# Altium schematic sheet Power.SchDoc: SEB/SEGR Parry dev. PWR System
size A2; ApprovedBy: N/A; CheckedBy: N/A; Author: BPS; CompanyName: N/A; DrawnBy: BPS; Engineer: BPS; Organization: N/A; Address1: N/A; Address2: N/A; Address3: N/A; Address4: N/A; DocumentNumber: SSP-03; Revision: A; SheetNumber: 2; SheetTotal: 2; Application_BuildNumber: 1
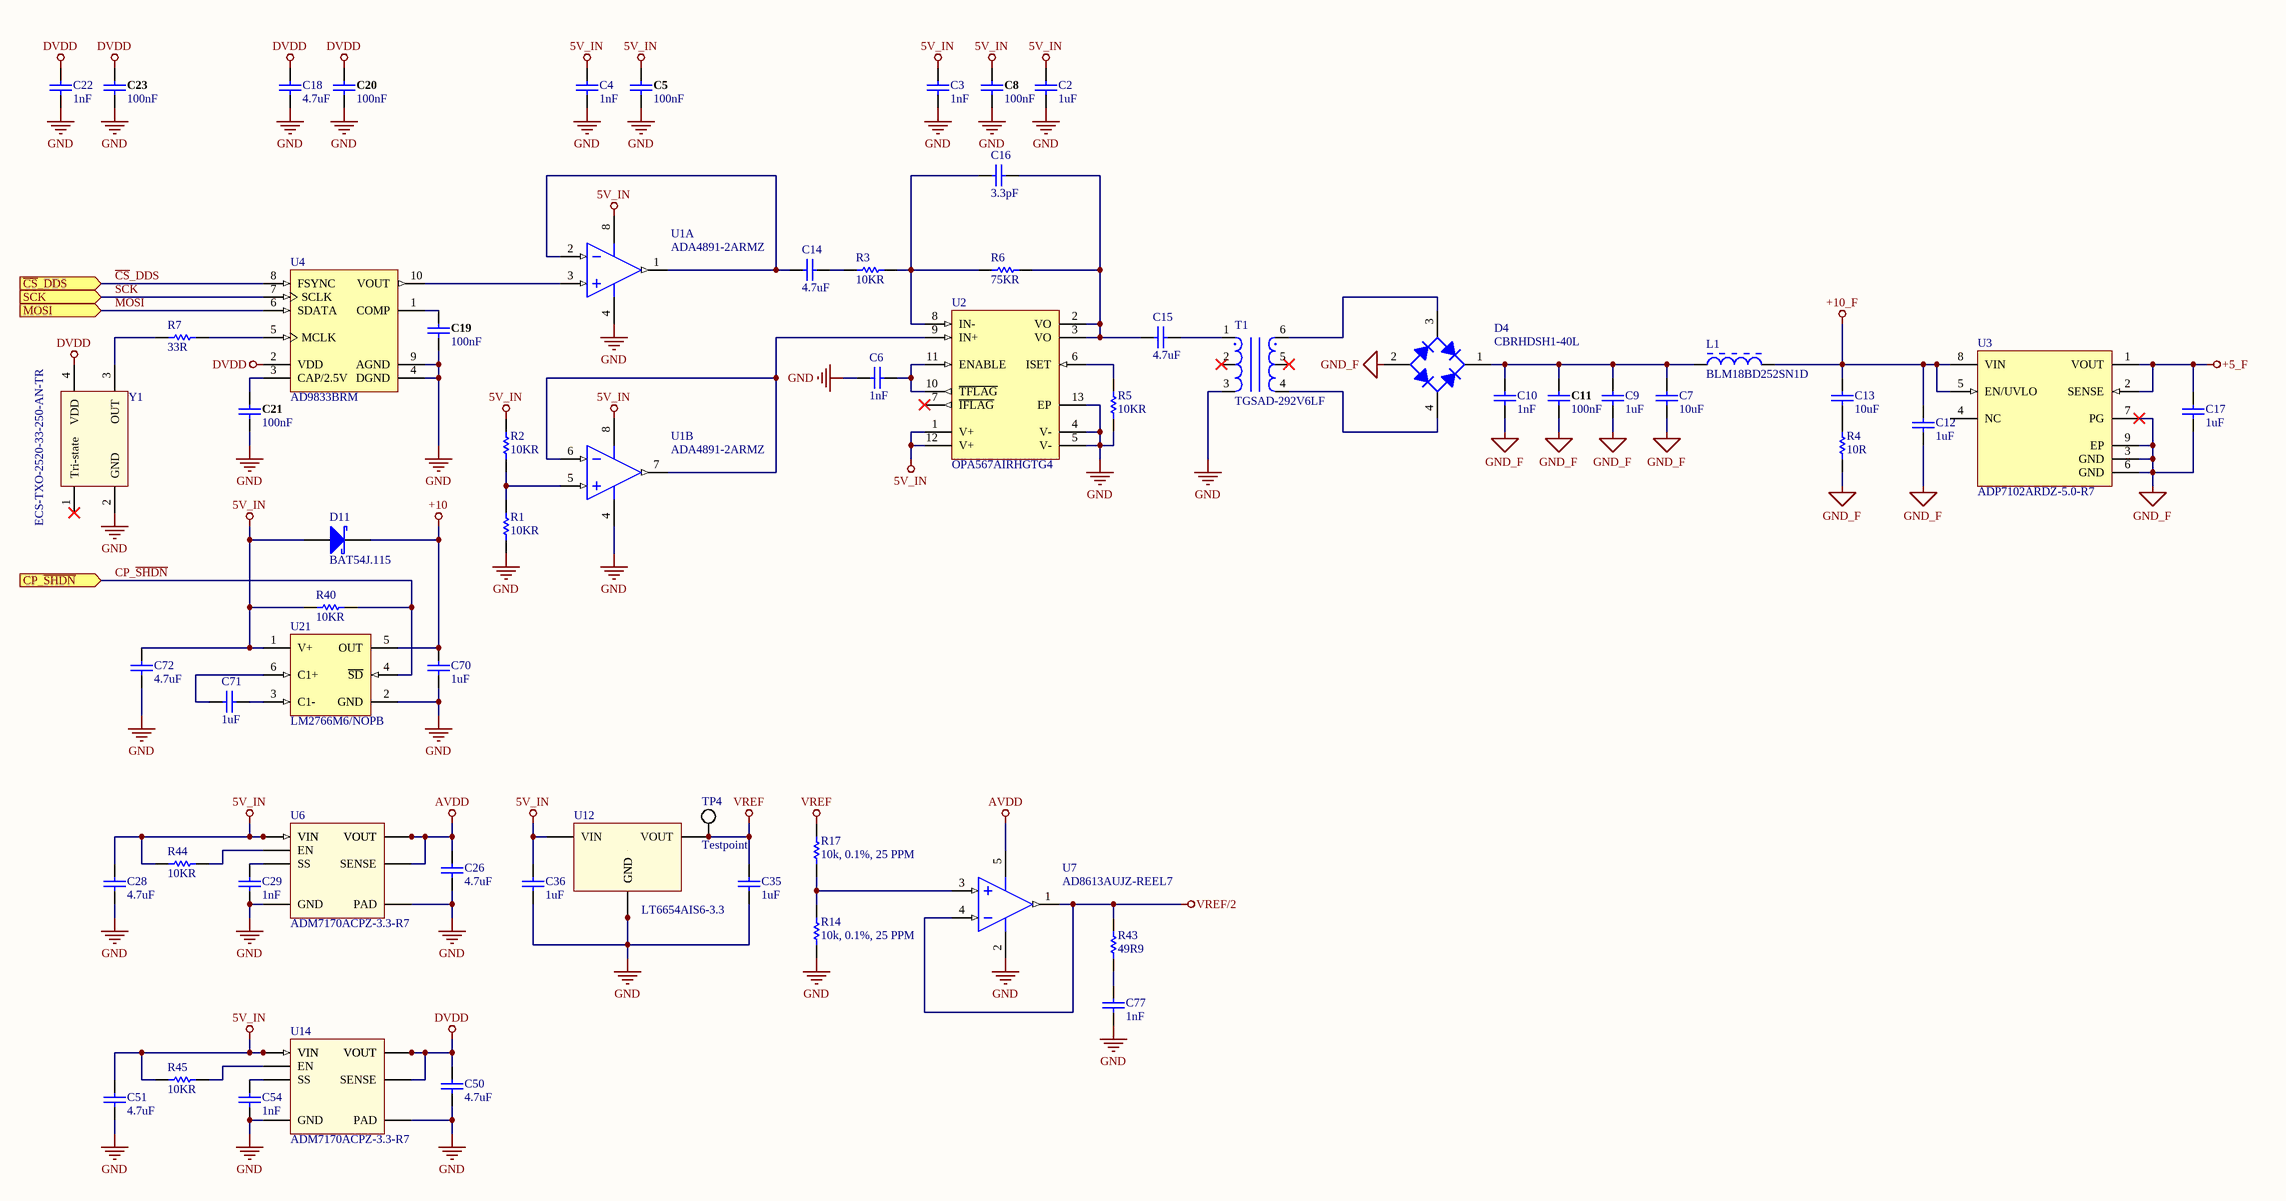
[diagram p0: Power.SchDoc]

## Parts
C2  1uF  [CAPC1608X90X40LL15T20]
C3  1nF  [CAPC1005X55X25ML5T10]
C4  1nF  [CAPC1005X55X25ML5T10]
C5  100nF  [CAPC1005]
C6  1nF  [CAPC1005X55X25ML5T10]
C7  10uF  [CAPC2013X95X45ML10T25]
C8  100nF  [CAPC1005]
C9  1uF  [CAPC1608X90X40LL15T20]
C10  1nF  [CAPC1005X55X25ML5T10]
C11  100nF  [CAPC1005]
C12  1uF  [CAPC1608X90X40LL15T20]
C13  10uF  [CAPC2013X95X45ML10T25]
C14  4.7uF  [CAPC1608X90X40LL15T20]
C15  4.7uF  [CAPC1608X90X40LL15T20]
C16  3.3pF  [CAPC1005X55X25ML05T05]
C17  1uF  [CAPC1608X90X40LL15T20]
C18  4.7uF  [CAPC1608X90X40LL15T20]
C19  100nF  [CAPC1005]
C20  100nF  [CAPC1005]
C21  100nF  [CAPC1005]
C22  1nF  [CAPC1005X55X25ML5T10]
C23  100nF  [CAPC1005]
C26  4.7uF  [CAPC1608X90X40LL15T20]
C28  4.7uF  [CAPC1608X90X40LL15T20]
C29  1nF  [CAPC1005X55X25ML5T10]
C35  1uF  [CAPC1608X90X40LL15T20]
C36  1uF  [CAPC1608X90X40LL15T20]
C50  4.7uF  [CAPC1608X90X40LL15T20]
C51  4.7uF  [CAPC1608X90X40LL15T20]
C54  1nF  [CAPC1005X55X25ML5T10]
C70  1uF  [CAPC1608X90X40LL15T20]
C71  1uF  [CAPC1608X90X40LL15T20]
C72  4.7uF  [CAPC1608X90X40LL15T20]
C77  1nF  [CAPC1005X55X25ML5T10]
D4  CBRHDSH1-40L  [HDDIP]
D11  BAT54J.115  [SOD-323]
L1  BLM18BD252SN1D  [MURA-BLM18-F-H1-CHIP-2_V]
R1  10KR  [RESC1005X40X25LL05T10]
R2  10KR  [RESC1005X40X25LL05T10]
R3  10KR  [RESC1005X40X25LL05T10]
R4  10R  [RESC1608X55X25LL10T15]
R5  10KR  [RESC1005X40X25LL05T10]
R6  75KR  [RESC1005X40X25LL05T10]
R7  33R  [RESC1005X40X25LL05T10]
R14  10k, 0.1%, 25 PPM  [RT0603]
R17  10k, 0.1%, 25 PPM  [RT0603]
R40  10KR  [RESC1005X40X25LL05T10]
R43  49R9  [RESC1005X40X25LL05T10]
R44  10KR  [RESC1005X40X25LL05T10]
R45  10KR  [RESC1005X40X25LL05T10]
T1  TGSAD-292V6LF  [TGSAD-V6LF]
TP4  Testpoint  [TESTPOINT]
U1  ADA4891-2ARMZ  [ADI-RM-8_L]  (parts A,B of 2)
U2  OPA567AIRHGTG4  [TI-RHG12-3120X3120TP_V]
U3  ADP7102ARDZ-5.0-R7  [ADI-RD-8-2_N]
U4  AD9833BRM  [ADI-RM-10_N]
U6  ADM7170ACPZ-3.3-R7  [LFCSP8]
U7  AD8613AUJZ-REEL7  [TSOT-23-5]
U12  LT6654AIS6-3.3  [SOT-23-6]
U14  ADM7170ACPZ-3.3-R7  [LFCSP8]
U21  LM2766M6/NOPB  [DBV0006A_N]
Y1  ECS-TXO-2520-33-250-AN-TR  [XTAL_ECS-TXO-2520-33-250]

## Ports
CP_~{SHDN} (in), MOSI (in), SCK (in), ~{CS}_DDS (in)

## Nets
5V_IN: C2.1 C3.2 C4.2 C5.1 C8.1 C28.2 C36.1 C51.2 C72.2 D11.2(A) R2.1 R40.2 R44.2 R45.2 U1.8(+VS) U2.1(V+) U2.12(V+) U6.7(VIN) U6.8(VIN) U12.4(VIN) U14.7(VIN) U14.8(VIN) U21.1(V+)
+5_F: C17.1 U3.1(VOUT) U3.2(SENSE)
+10: C70.2 D11.1(K) U21.5(OUT)
+10_F: C12.1 C13.2 L1.2 U3.5(EN/UVLO) U3.8(VIN)
AVDD: C26.2 U6.1(VOUT) U6.2(VOUT) U6.3(SENSE) U7.5
DVDD: C18.2 C20.1 C22.2 C23.1 C50.2 U4.2(VDD) U14.1(VOUT) U14.2(VOUT) U14.3(SENSE) Y1.4(VDD)
GND: C2.2 C3.1 C4.1 C5.2 C6.2 C8.2 C18.1 C19.2 C20.2 C21.2 C22.1 C23.2 C26.1 C28.1 C29.1 C35.2 C36.2 C50.1 C51.1 C54.1 C70.1 C72.1 C77.2 R1.2 R5.1 R14.1 T1.3 U1.4(-VS) U2.4(V-) U2.5(V-) U2.13(EP) U4.4(DGND) U4.9(AGND) U6.6(GND) U6.9(PAD) U7.2 U12.1(GND) U12.2(GND) U14.6(GND) U14.9(PAD) U21.2(GND) Y1.2(GND)
GND_F: C7.1 C9.2 C10.1 C11.2 C12.2 C17.2 D4.2(A) R4.1 U3.3(GND) U3.6(GND) U3.7(PG) U3.9(EP)
VREF: C35.1 R17.2 TP4.1 U12.6(VOUT)
VREF/2: R43.1 U7.1 U7.4
~{CS}_DDS: U4.8(FSYNC) ; port ~{CS}_DDS
CP_~{SHDN}: R40.1 U21.4(~{SD}) ; port CP_~{SHDN}
MOSI: U4.6(SDATA) ; port MOSI
SCK: U4.7(SCLK) ; port SCK
NetC6_1: C6.1 U2.10(~{TFLAG}) U2.11(ENABLE)
NetC7_2: C7.2 C9.1 C10.2 C11.1 D4.1(K) L1.1
NetC13_1: C13.1 R4.2
NetC14_1: C14.1 R3.1
NetC14_2: C14.2 U1.1(OUT_1) U1.2(-IN_1)
NetC15_1: C15.1 T1.1
NetC15_2: C15.2 C16.2 R6.2 U2.2(VO) U2.3(VO)
NetC16_1: C16.1 R3.2 R6.1 U2.8(IN-)
NetC19_1: C19.1 U4.1(COMP)
NetC21_1: C21.1 U4.3(CAP/2.5V)
NetC29_2: C29.2 U6.4(SS)
NetC54_2: C54.2 U14.4(SS)
NetC71_1: C71.1 U21.3(C1-)
NetC71_2: C71.2 U21.6(C1+)
NetC77_1: C77.1 R43.2
NetD4_3: D4.3(C) T1.6
NetD4_4: D4.4(C) T1.4
NetR1_1: R1.1 R2.2 U1.5(+IN_2)
NetR5_2: R5.2 U2.6(ISET)
NetR7_1: R7.1 Y1.3(OUT)
NetR7_2: R7.2 U4.5(MCLK)
NetR14_2: R14.2 R17.1 U7.3
NetR44_1: R44.1 U6.5(EN)
NetR45_1: R45.1 U14.5(EN)
NetU1_3: U1.3(+IN_1) U4.10(VOUT)
NetU1_6: U1.6(-IN_2) U1.7(OUT_2) U2.9(IN+)
NetU12_3: U12.3(DNC) U12.5(DNC)

Not connected (* = marked no-connect by the designer): T1 2* 5*; U2 7(~{IFLAG})*; U3 4(NC); Y1 1(Tri-state)*

## Notes on the sheet
- Title
- Size:
- Date:
- File:
- A2
- Number:
- Time:
- Revision:
- Sheet
- of

## Library data of the parts
C2 C9 C12 C17 C35 C36 C70 C71 = CMP-2000-06074-1: CC0603KRX5R7BB105; Manufacturer: Yageo; Voltage - Rated: 10V; Temperature Coefficient: X5R; Tolerance: ±10%; Online Catalog: CCSeries; Other Names: 311-1455-6; Capacitance: 4.7µF; EDA / CAD Models: DownloadfromAcceleratedDesigns; Thickness (Max): 0.035"(0.90mm); Mounting Type: SurfaceMount,MLCC; Datasheet Version: Rev. 21, 01/2016; Datasheet URL: http://www.yageo.com/documents/recent/UPY-GPHC_X5R_4V-to-50V-21.pdf; Size / Dimension: 0.063"Lx0.031"W(1.60mmx0.80mm); Standard Package: 1; Operating Temperature: -55°C~85°C; Category: Capacitors; Manufacturer URL: http://www.yageo.com/; Package Reference: 0603; Family: CeramicCapacitors; Series: CC; Packaging: Digi-Reel®; Mounting Technology: SurfaceMount; Package Description: 2-Pin Surface Mount Device, Body 1.6 x 0.8 mm; Applications: GeneralPurpose; Package / Case: 0603(1608Metric)
C3 C4 C6 C10 C22 C29 C54 C77 = CMP-2100-03592-1: CC0402JRX7R9BB102; Manufacturer: Yageo; Voltage Rating (DC): 50V; Tolerance: 10%; Dielectric: X7R; Capacitance: 10nF; Package Description: 2-Pin Surface Mount Device, Body 1 x 0.5 mm; REACH SVHC: NoSVHC; Depth: 0.5mm; Length: 1mm; Radiation Hardening: No; Thickness: 0.022inch; Lead Free: LeadFree; Height: 0.5mm; Packaging: TapeandReel; RoHSCompliant: True; Termination: SMD/SMT; Min Operating Temperature: -55degC; Composition: Ceramic; Case Code (Metric): 1005; Voltage Rating: 50V; Case Code (Imperial): 0402; Mount: SurfaceMount; Package Reference: 0402; Voltage: 50V; Manufacturer URL: http://www.yageo.com/; Width: 0.5mm; Package Quantity: 1; Datasheet Version: Rev. 15, 10/2016; Max Operating Temperature: 125degC; Datasheet URL: http://www.yageo.com/documents/recent/UPY-GPHC_X7R_6.3V-to-50V_15.pdf; Case/Package: 0402
C5 C8 C11 C19-C21 C23 = CMP-0001-00074-1: CC0402KRX7R7BB104; Rated Voltage: 16 V; Tolerance: 10 %; Polarity: Non-Polarized; Dielectric: X7R; Capacitance: 0.1 uF; ClassName: Board Template Device; Status: Production; Mounting Technology: Surface Mount; Technology: Ceramic; Category: Capacitor; Publisher: Altium
C7 C13 = CMP-2007-00182-1: GRM219R61E106KA12D; Manufacturer: Murata; Part Number: GRM219R61E106KA12D
C14 C15 C18 C26 C28 C50 C51 C72 = CMP-2000-06074-1: CC0603KRX5R6BB475; Manufacturer: Yageo; Voltage - Rated: 10V; Temperature Coefficient: X5R; Tolerance: ±10%; Online Catalog: CCSeries; Other Names: 311-1455-6; Capacitance: 4.7µF; EDA / CAD Models: DownloadfromAcceleratedDesigns; Thickness (Max): 0.035"(0.90mm); Mounting Type: SurfaceMount,MLCC; Datasheet Version: Rev. 21, 01/2016; Datasheet URL: http://www.yageo.com/documents/recent/UPY-GPHC_X5R_4V-to-50V-21.pdf; Size / Dimension: 0.063"Lx0.031"W(1.60mmx0.80mm); Standard Package: 1; Operating Temperature: -55°C~85°C; Category: Capacitors; Manufacturer URL: http://www.yageo.com/; Package Reference: 0603; Family: CeramicCapacitors; Series: CC; Packaging: Digi-Reel®; Mounting Technology: SurfaceMount; Package Description: 2-Pin Surface Mount Device, Body 1.6 x 0.8 mm; Applications: GeneralPurpose; Package / Case: 0603(1608Metric)
C16 = CMP-2100-03589-1: CC0402CRNPO9BN3R3; Manufacturer: Yageo; Insulation Resistance: 100GR; Voltage Rating (DC): 50V; Dielectric Material: Ceramic; Tolerance: 5%; Temperature Coefficient: 30ppm/degC; Dielectric: C0G; Capacitance: 10pF; Termination: SMD/SMT; Package Reference: 0402; Lead Free: LeadFree; Composition: Ceramic; Case Code (Metric): 1005; Voltage Rating: 50V; Packaging: TapeandReel; Manufacturer URL: http://www.yageo.com/; REACH SVHC: NoSVHC; Max Operating Temperature: 125degC; Length: 1mm; Mount: SurfaceMount; Depth: 0.5mm; Min Operating Temperature: -55degC; Number of Pins: 2; Width: 0.02inch; Datasheet Version: Rev. 14, 07/2016; Package Quantity: 1; Datasheet URL: http://www.yageo.com/documents/recent/UPY-GP_NP0_16V-to-50V_14.pdf; Case Code (Imperial): 0402; RoHSCompliant: True; Radiation Hardening: No; Height: 0.5mm; Case/Package: 0402; Thickness: 0.022inch; Package Description: 2-Pin Surface Mount Device, Body 1 x 0.5 mm; Voltage: 50V
D4 = CBRHDSH1-40L: The CENTRAL SEMICONDUCTOR CBRHDSH1-40L / is a full wave bridge rectifier mounted in a durable / epoxy surface mount molded case, utilizing glass / passivated chips.
L1 = CMP-0686-00418-1: Chip Ferrite Bead for High-speed Signal Lines, 2500 Ohm, 50 mA, -55 to 125 degC, 1.6 x 0.8 x 0.95 mm SMD, Tape and Reel; Manufacturer: Murata; Rated Current: 50 mA; DC Resistance: 1.50 Ohm Max.; Impedance (at 100 MHz): 2500 Ohm +/- 25%; ComponentLink2Description: Datasheet; ComponentLink3Description: Package Specification; ComponentLink3URL: http://www.murata.com/products/catalog/pdf/c31e.pdf; Operating Temperature Range: -55 to 125 degC; ComponentLink1URL: http://www.murata.com/; Mounting Technology: Surface Mount; PartNumber: BLM18BD252SN1D; PackageReference: BLM18_H950-2; ComponentLink2URL: http://www.murata.com/products/catalog/pdf/c31e.pdf; DatasheetVersion: 08/2013; PackageDescription: 2-Pin Chip, Body 1.6 x 0.8 mm, Pitch 1.65 mm; ComponentLink1Description: Manufacturer URL; Packing: Tape and Reel
R1-R3 R5 R40 R44 R45 = CMP-2002-07353-1: RC0402FR-0710KL; Manufacturer: Yageo / Phycomp; Part Number: RC0402FR-0710KL
R4 = CMP-1659-00008-2: RC0603FR-0710RL; Manufacturer: Yageo; ComponentLink1Description: Datasheet; PackageReference: 0603; PartNumber: RC0603FR-0710RL; ComponentLink1URL: http://www.yageo.com/documents/recent/PYu-RC_Group_51_RoHS_L_04.pdf
R6 = CMP-2002-07797-1: RC0402FR-0775KL; Manufacturer: Yageo / Phycomp; Part Number: RC0402FR-0775KL
R7 = CMP-2002-07619-1: RC0402FR-0733RL; Manufacturer: Yageo / Phycomp; Part Number: RC0402FR-0733RL
R14 R17 = RT0603BRD0710KL
R43 = CMP-2002-07709-1: RC0402FR-0749R9L; Manufacturer: Yageo / Phycomp; Part Number: RC0402FR-0749R9L
T1 = TGSAD-292V6LF: 1:5
U1 = CMP-0384-01745-1: Double Channel Single-Supply Operation Operational Amplifier, 220 MHz BW, 170 V/us SR, Industrial, 8-pin SOP (RM-8), Tube; Manufacturer: Analog Devices; Input Offset Voltage: 2.5mV; Small Signal Bandwidth: 220MHz; Iq/Amp: 4.4mA; Input Bias Current: 2pA; Amplifiers Per Package: 2; V Span Max: 5.5V; V Span Min: 2.7V; ComponentLink1URL: http://www.analog.com/en/index.html; ComponentLink2URL: http://www.analog.com/static/imported-files/data_sheets/ADA4891-1_4891-2_4891-3_4891-4.PDF; ComponentLink3URL: http://www.analog.com/static/imported-files/packages/PKG_PDF/MSOP%28RM%29/RM_8.pdf; Slew Rate: 170V/us; ComponentLink2Description: Datasheet; Mounting Technology: Surface Mount; PartNumber: ADA4891-2ARMZ; ComponentLink1Description: Manufacturer URL; ComponentLink3Description: Package Specification; Packing: Tube; Generic Part Number: ADA4891-2; DatasheetVersion: Rev. D; PackageReference: RM-8; PackageDescription: 8-Pin Mini Small Outline Package, Body 3 x 3 mm, Pitch 0.65 mm; Code_JEDEC: MO-187-AA; PartId: 1
U2 = CMP-0272-04145-1: Rail-to-Rail I/O, 2 A Power Amplifier, 2.7 to 5.5 V, -55 to 125 degC, 12-pin QFN (RHG12), Green (RoHS & no Sb/Br); CMRR(Min)(dB): 80; Packing: SMALL T&R; Sub Family: High Output Current Amplifier (>=50mA), Low Input Bias Current Amp (<=10pA), Low Supply Voltage Amplifier (<=2.7V), Precision Amplifier; Number of Channels: 1; Total Supply Voltage(Max)(+5V is 5, +/-5V is 10): 5.5; IIB(Max)(pA): 10; Slew Rate(Typ)(V/us): 1.2; Iq per channel(Max)(mA): 6; Vio (25C)(Max)(mV): 2; Total Supply Voltage(Min)(+5V is 5, +/-5V is 10): 2.7; Offset Drift(Typ)(uV/C): 1.3; Rating: Catalog; PartNumber: OPA567AIRHGTG4; ComponentLink3URL: http://www.ti.com/litv/pdf/mpqf142c; PackageDescription: 12-Pin Plastic Quad Flatpack No-Lead, Body 5 x 5 mm, Pitch 1 mm; Mounting Technology: Surface Mount; ComponentLink3Description: Package Specification; ComponentLink1URL: http://www.ti.com/; ComponentLink1Description: Manufacturer URL; PackageReference: RHG12-3120X3120TP; Code_JEDEC: MO-220; ComponentLink2Description: Datasheet; ComponentLink2URL: http://www.ti.com/lit/ds/symlink/opa567.pdf; Eco-Plan: Green (RoHS & no Sb/Br); PackageVersion: 4205052/E, 12/2010; GBW(Typ)(MHz): 1.2; DatasheetVersion: SBOS287A
U3 = CMP-0786-00210-1: 300 mA, Low Noise, CMOS LDO, 3.3 to 20 V Vin, 5 V Vout, Industrial, 8-pin SOIC (RD-8-2), Reel; Manufacturer: Analog Devices; Preset Vout Values (V): 5.0; Vin (max) (V): 20; Iout max: 300mA; Supply Current IGND @ Small Load: 400uA; Vin (min) (V): 3.3; ComponentLink4URL: Product URL:http://www.analog.com/en/ADP7102/productSearch.html; ComponentLink3URL: http://www.analog.com/static/imported-files/packages/62062404671038RD_8_2.pdf; Mounting Technology: Surface Mount; PackageVersion: Jan-05; Packing: Reel; ComponentLink1Description: Manufacturer URL; PartNumber: ADP7102ARDZ-5.0-R7; ComponentLink1URL: http://www.analog.com/en/index.html; ComponentLink2Description: Datasheet; ComponentLink3Description: Package Specification; DatasheetVersion: Rev. A; PackageDescription: 8-Pin Standard Small Outline Package, Body 4.9 x 3.9 mm, Pitch 1.27 mm; PackageReference: RD-8-2; Code_JEDEC: MS-012-AA; ComponentLink2URL: http://www.analog.com/static/imported-files/data_sheets/ADP7102.pdf; ComponentLink4Description: URL Link1
U4 = CMP-0293-00075-1: Low Power, 12.65 mW, 2.3 V to 5.5 V, Programmable Waveform Generator, 10-Bit, Serial, RM-10, 50 Tube; Tuning Word Width (bits): 28bit; Resolution (Bits): 10bit; Master fclk: 25MHz; REFCLK Multiplier: No; Compliance Range (V): 650mV; I Supply total (max): 5.5mA; FS Iout (mA nom): 3mA; DatasheetVersion: Rev. D; I/O Interface: Serial; PackageReference: RM-10; PackageDescription: 10-Lead Mini Small Outline Package [MSOP]; PackageVersion: 5/8/2005; ComponentLink3URL: http://www.analog.com/static/imported-files/packages/PKG_PDF/MSOP%28RM%29/RM_10.pdf; ComponentLink1Description: Manufacturer URL; ComponentLink2Description: Datasheet; Code_JEDEC: MO-187-BA; ComponentLink2URL: http://www.analog.com/static/imported-files/data_sheets/AD9833.pdf; ComponentLink1URL: www.analog.com; ComponentLink3Description: Package Specification
U7 = AD8613AUJZ-REEL7: Low Cost Micropower, Low Noise CMOS / Rail-to-Rail, Input/Output Operational Amplifiers
U12 = LT6654AIS6-3.3: Precision Wide Supply High Output Drive Low Noise Reference
U21 = CMP-0065-00090-3: Switched Capacitor Voltage Converter, 6-pin SOT-23, Pb-Free; Manufacturer: Texas Instruments; PackageTopMarking: S16B*XTT; PowerWise: N; CompType: Switch Caps; Code_JEDEC: MO-178-AB; Code_IPC: SOT26A-6; PackageReference: DBV0006A; PinCount: 6; PackageDescription: Molded SOT-23, .115 x .063 x .040in Body, 6 Lead, .0375in in Pitch; ComponentLink1Description: Datasheet URL; ComponentLink1URL: http://www.ti.com/general/docs/lit/getliterature.tsp?genericPartNumber=LM2766&fileType=pdf; RoHS: Y